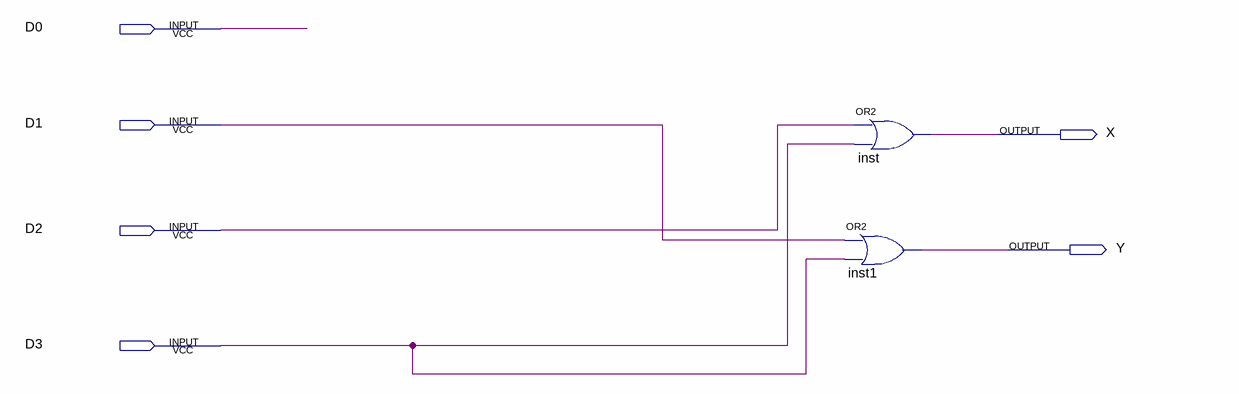
[diagram p0: schematic sheet]
// Quartus schematic CODDOSACUATRO.bdf as structural Verilog: 2 symbols, 6 pins
module CODDOSACUATRO (
  input  D0,
  input  D1,
  input  D2,
  input  D3,
  output X,
  output Y
);

  or inst1 (Y, D1, D3);
  or inst (X, D2, D3);
endmodule
